# Altium schematic sheet 03_H3DRAM.SchDoc
size A2
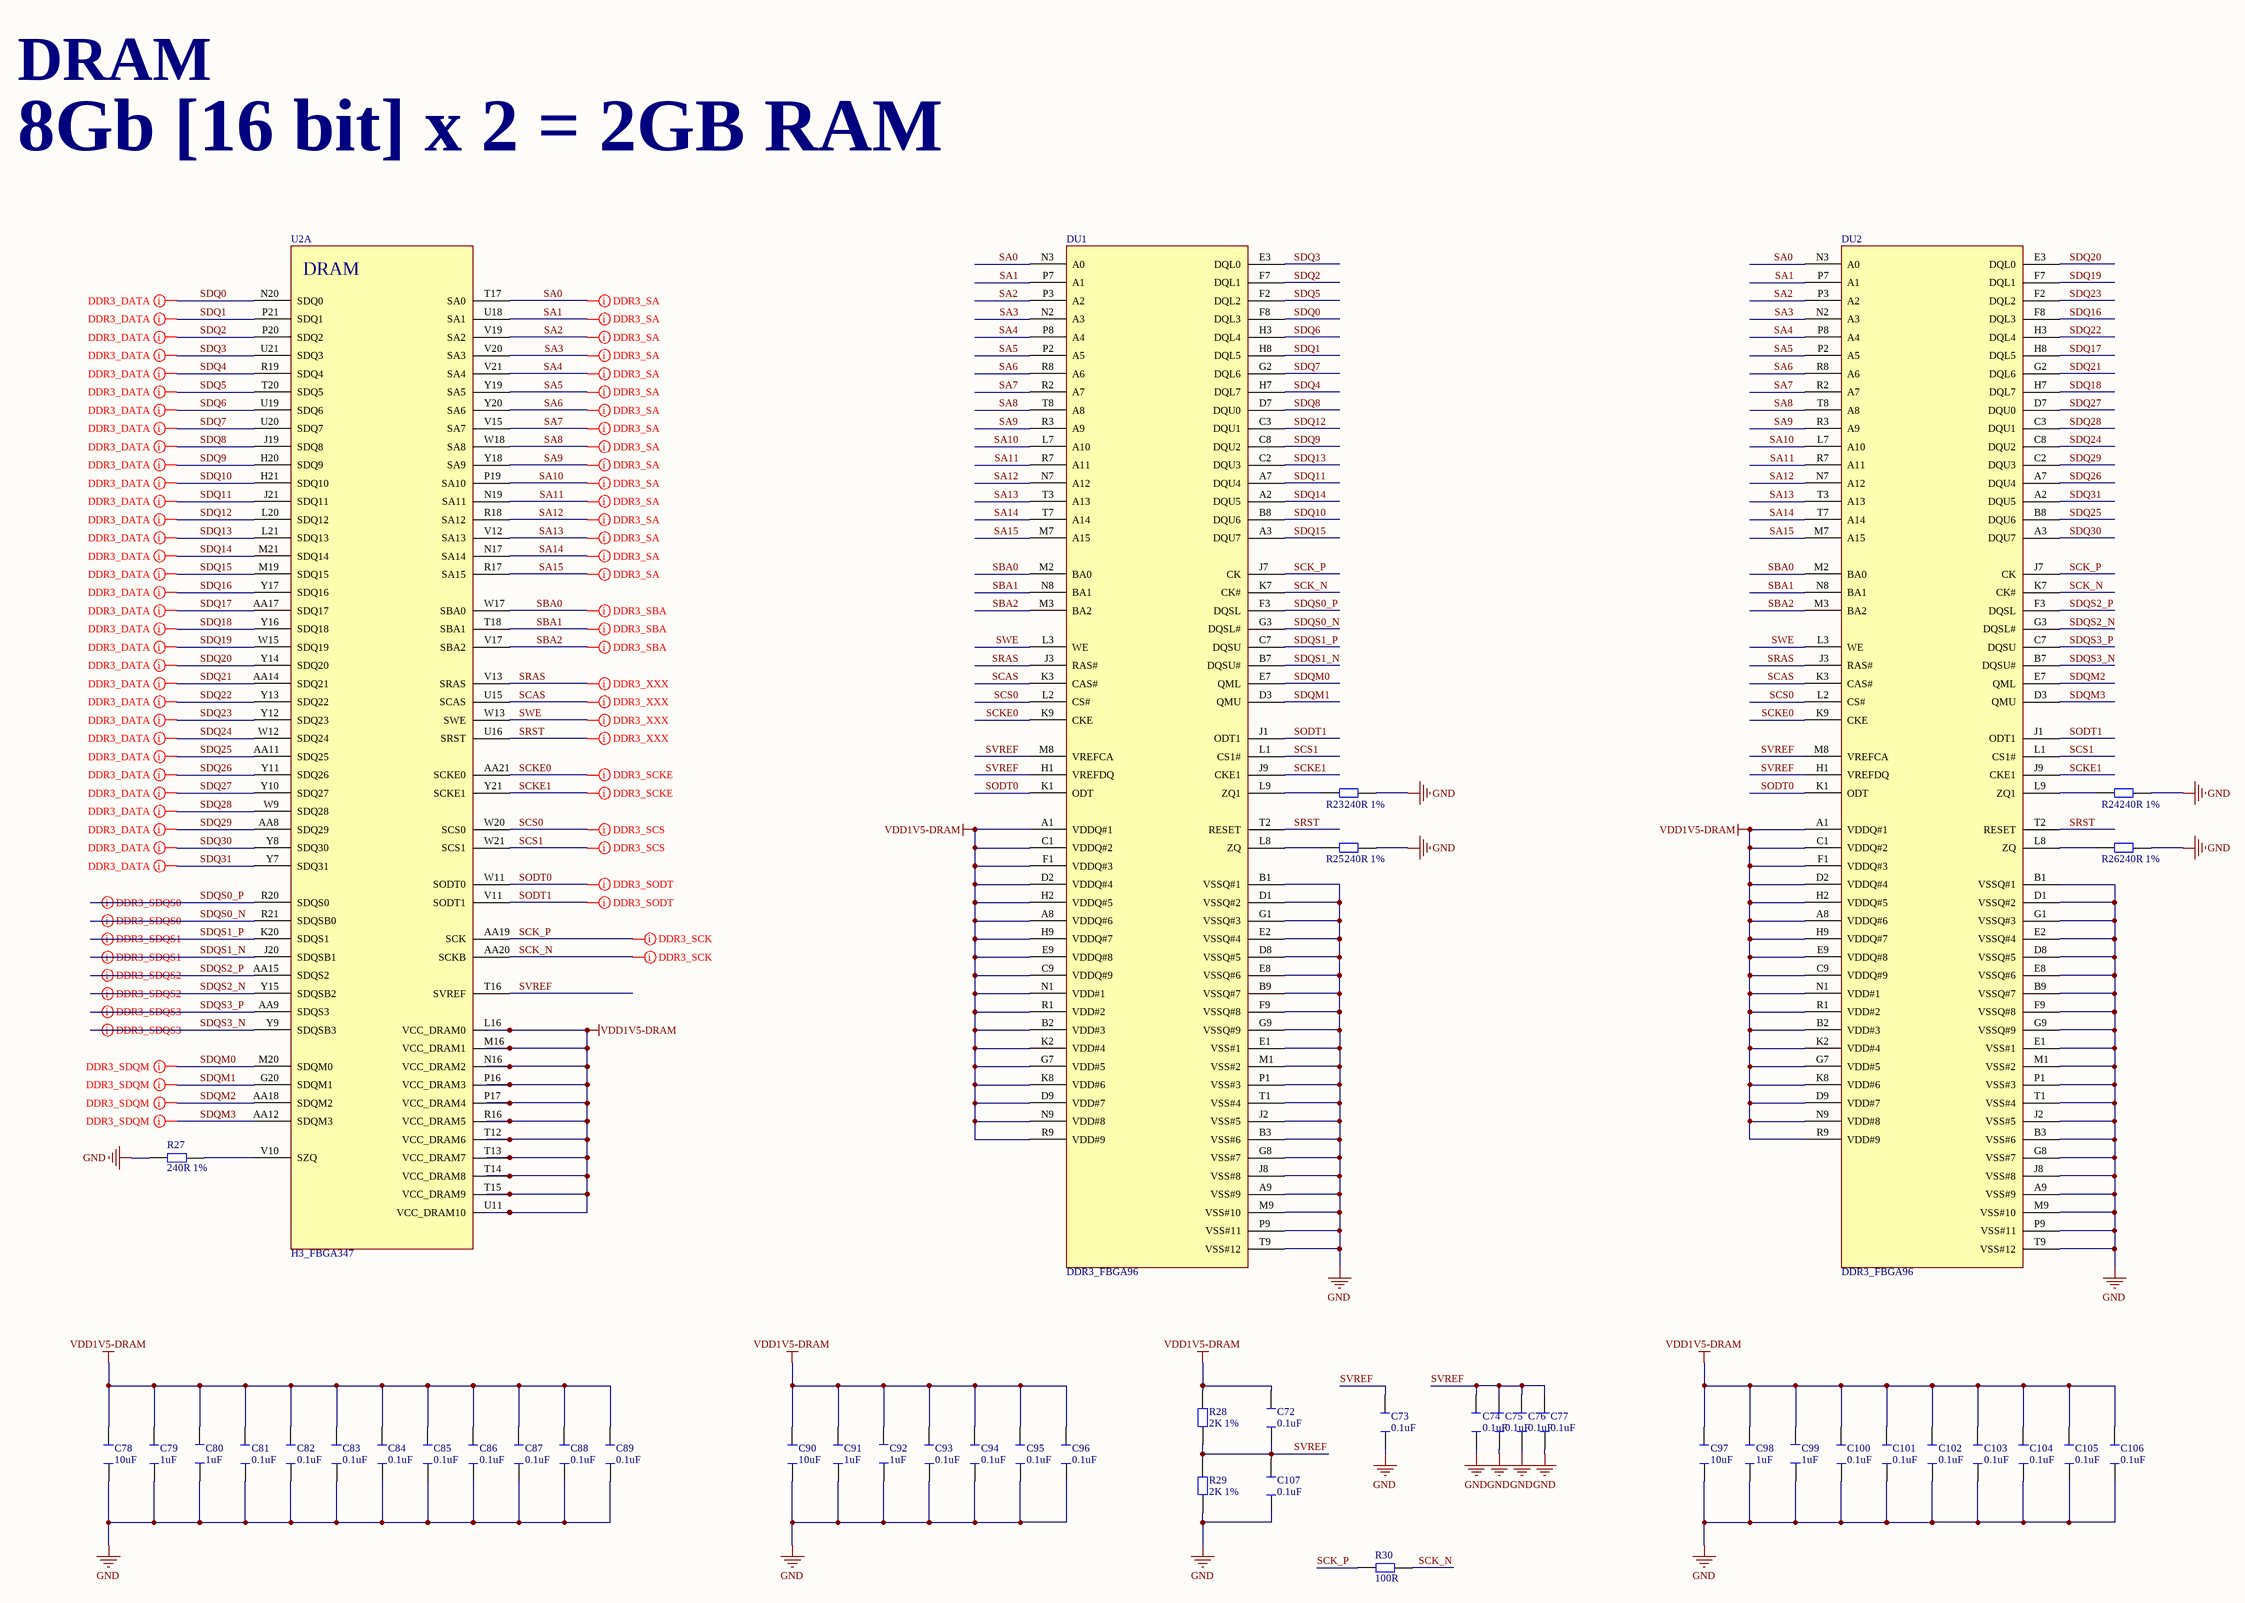
[diagram p0: 03_H3DRAM.SchDoc]

## Parts
C72  0.1uF  [C0402]
C73  0.1uF  [C0402]
C74  0.1uF  [C0402]
C75  0.1uF  [C0402]
C76  0.1uF  [C0402]
C77  0.1uF  [C0402]
C78  10uF  [C0402]
C79  1uF  [C0402]
C80  1uF  [C0402]
C81  0.1uF  [C0402]
C82  0.1uF  [C0402]
C83  0.1uF  [C0402]
C84  0.1uF  [C0402]
C85  0.1uF  [C0402]
C86  0.1uF  [C0402]
C87  0.1uF  [C0402]
C88  0.1uF  [C0402]
C89  0.1uF  [C0402]
C90  10uF  [C0402]
C91  1uF  [C0402]
C92  1uF  [C0402]
C93  0.1uF  [C0402]
C94  0.1uF  [C0402]
C95  0.1uF  [C0402]
C96  0.1uF  [C0402]
C97  10uF  [C0402]
C98  1uF  [C0402]
C99  1uF  [C0402]
C100  0.1uF  [C0402]
C101  0.1uF  [C0402]
C102  0.1uF  [C0402]
C103  0.1uF  [C0402]
C104  0.1uF  [C0402]
C105  0.1uF  [C0402]
C106  0.1uF  [C0402]
C107  0.1uF  [C0402]
DU1  DDR3_FBGA96  [DDR3_FBGA96]
DU2  DDR3_FBGA96  [DDR3_FBGA96]
R23  240R 1%  [R0402]
R24  240R 1%  [R0402]
R25  240R 1%  [R0402]
R26  240R 1%  [R0402]
R27  240R 1%  [R0402]
R28  2K 1%  [R0402]
R29  2K 1%  [R0402]
R30  100R  [R0402]
U2  H3_FBGA347  [H3_FBGA327]  (part A of 16)

## Nets
GND: C73.1 C74.1 C75.1 C76.1 C77.1 C78.1 C79.1 C80.2 C81.1 C82.1 C83.1 C84.1 C85.1 C86.1 C87.1 C88.1 C89.1 C90.1 C91.1 C92.2 C93.1 C94.1 C95.1 C96.1 C97.1 C98.1 C99.2 C100.1 C101.1 C102.1 C103.1 C104.1 C105.1 C106.1 C107.1 DU1.A9(VSS#9) DU1.B1(VSSQ#1) DU1.B3(VSS#6) DU1.B9(VSSQ#7) DU1.D1(VSSQ#2) DU1.D8(VSSQ#5) DU1.E1(VSS#1) DU1.E2(VSSQ#4) DU1.E8(VSSQ#6) DU1.F9(VSSQ#8) DU1.G1(VSSQ#3) DU1.G8(VSS#7) DU1.G9(VSSQ#9) DU1.J2(VSS#5) DU1.J8(VSS#8) DU1.M1(VSS#2) DU1.M9(VSS#10) DU1.P1(VSS#3) DU1.P9(VSS#11) DU1.T1(VSS#4) DU1.T9(VSS#12) DU2.A9(VSS#9) DU2.B1(VSSQ#1) DU2.B3(VSS#6) DU2.B9(VSSQ#7) DU2.D1(VSSQ#2) DU2.D8(VSSQ#5) DU2.E1(VSS#1) DU2.E2(VSSQ#4) DU2.E8(VSSQ#6) DU2.F9(VSSQ#8) DU2.G1(VSSQ#3) DU2.G8(VSS#7) DU2.G9(VSSQ#9) DU2.J2(VSS#5) DU2.J8(VSS#8) DU2.M1(VSS#2) DU2.M9(VSS#10) DU2.P1(VSS#3) DU2.P9(VSS#11) DU2.T1(VSS#4) DU2.T9(VSS#12) R23.1 R24.1 R25.1 R26.1 R27.1 R29.1
VDD1V5-DRAM: C72.2 C78.2 C79.2 C80.1 C81.2 C82.2 C83.2 C84.2 C85.2 C86.2 C87.2 C88.2 C89.2 C90.2 C91.2 C92.1 C93.2 C94.2 C95.2 C96.2 C97.2 C98.2 C99.1 C100.2 C101.2 C102.2 C103.2 C104.2 C105.2 C106.2 DU1.A1(VDDQ#1) DU1.A8(VDDQ#6) DU1.B2(VDD#3) DU1.C1(VDDQ#2) DU1.C9(VDDQ#9) DU1.D2(VDDQ#4) DU1.D9(VDD#7) DU1.E9(VDDQ#8) DU1.F1(VDDQ#3) DU1.G7(VDD#5) DU1.H2(VDDQ#5) DU1.H9(VDDQ#7) DU1.K2(VDD#4) DU1.K8(VDD#6) DU1.N1(VDD#1) DU1.N9(VDD#8) DU1.R1(VDD#2) DU1.R9(VDD#9) DU2.A1(VDDQ#1) DU2.A8(VDDQ#6) DU2.B2(VDD#3) DU2.C1(VDDQ#2) DU2.C9(VDDQ#9) DU2.D2(VDDQ#4) DU2.D9(VDD#7) DU2.E9(VDDQ#8) DU2.F1(VDDQ#3) DU2.G7(VDD#5) DU2.H2(VDDQ#5) DU2.H9(VDDQ#7) DU2.K2(VDD#4) DU2.K8(VDD#6) DU2.N1(VDD#1) DU2.N9(VDD#8) DU2.R1(VDD#2) DU2.R9(VDD#9) R28.2 U2.L16(VCC_DRAM0) U2.M16(VCC_DRAM1) U2.N16(VCC_DRAM2) U2.P16(VCC_DRAM3) U2.P17(VCC_DRAM4) U2.R16(VCC_DRAM5) U2.T12(VCC_DRAM6) U2.T13(VCC_DRAM7) U2.T14(VCC_DRAM8) U2.T15(VCC_DRAM9) U2.U11(VCC_DRAM10)
SA0: DU1.N3(A0) DU2.N3(A0) U2.T17(SA0)
SA1: DU1.P7(A1) DU2.P7(A1) U2.U18(SA1)
SA2: DU1.P3(A2) DU2.P3(A2) U2.V19(SA2)
SA3: DU1.N2(A3) DU2.N2(A3) U2.V20(SA3)
SA4: DU1.P8(A4) DU2.P8(A4) U2.V21(SA4)
SA5: DU1.P2(A5) DU2.P2(A5) U2.Y19(SA5)
SA6: DU1.R8(A6) DU2.R8(A6) U2.Y20(SA6)
SA7: DU1.R2(A7) DU2.R2(A7) U2.V15(SA7)
SA8: DU1.T8(A8) DU2.T8(A8) U2.W18(SA8)
SA9: DU1.R3(A9) DU2.R3(A9) U2.Y18(SA9)
SA10: DU1.L7(A10) DU2.L7(A10) U2.P19(SA10)
SA11: DU1.R7(A11) DU2.R7(A11) U2.N19(SA11)
SA12: DU1.N7(A12) DU2.N7(A12) U2.R18(SA12)
SA13: DU1.T3(A13) DU2.T3(A13) U2.V12(SA13)
SA14: DU1.T7(A14) DU2.T7(A14) U2.N17(SA14)
SA15: DU1.M7(A15) DU2.M7(A15) U2.R17(SA15)
SBA0: DU1.M2(BA0) DU2.M2(BA0) U2.W17(SBA0)
SBA1: DU1.N8(BA1) DU2.N8(BA1) U2.T18(SBA1)
SBA2: DU1.M3(BA2) DU2.M3(BA2) U2.V17(SBA2)
SCAS: DU1.K3(CAS#) DU2.K3(CAS#) U2.U15(SCAS)
SCK_N: DU1.K7(CK#) DU2.K7(CK#) R30.2 U2.AA20(SCKB)
SCK_P: DU1.J7(CK) DU2.J7(CK) R30.1 U2.AA19(SCK)
SCKE0: DU1.K9(CKE) DU2.K9(CKE) U2.AA21(SCKE0)
SCKE1: DU1.J9(CKE1) DU2.J9(CKE1) U2.Y21(SCKE1)
SCS0: DU1.L2(CS#) DU2.L2(CS#) U2.W20(SCS0)
SCS1: DU1.L1(CS1#) DU2.L1(CS1#) U2.W21(SCS1)
SDQ0: DU1.F8(DQL3) U2.N20(SDQ0)
SDQ1: DU1.H8(DQL5) U2.P21(SDQ1)
SDQ2: DU1.F7(DQL1) U2.P20(SDQ2)
SDQ3: DU1.E3(DQL0) U2.U21(SDQ3)
SDQ4: DU1.H7(DQL7) U2.R19(SDQ4)
SDQ5: DU1.F2(DQL2) U2.T20(SDQ5)
SDQ6: DU1.H3(DQL4) U2.U19(SDQ6)
SDQ7: DU1.G2(DQL6) U2.U20(SDQ7)
SDQ8: DU1.D7(DQU0) U2.J19(SDQ8)
SDQ9: DU1.C8(DQU2) U2.H20(SDQ9)
SDQ10: DU1.B8(DQU6) U2.H21(SDQ10)
SDQ11: DU1.A7(DQU4) U2.J21(SDQ11)
SDQ12: DU1.C3(DQU1) U2.L20(SDQ12)
SDQ13: DU1.C2(DQU3) U2.L21(SDQ13)
SDQ14: DU1.A2(DQU5) U2.M21(SDQ14)
SDQ15: DU1.A3(DQU7) U2.M19(SDQ15)
SDQ16: DU2.F8(DQL3) U2.Y17(SDQ16)
SDQ17: DU2.H8(DQL5) U2.AA17(SDQ17)
SDQ18: DU2.H7(DQL7) U2.Y16(SDQ18)
SDQ19: DU2.F7(DQL1) U2.W15(SDQ19)
SDQ20: DU2.E3(DQL0) U2.Y14(SDQ20)
SDQ21: DU2.G2(DQL6) U2.AA14(SDQ21)
SDQ22: DU2.H3(DQL4) U2.Y13(SDQ22)
SDQ23: DU2.F2(DQL2) U2.Y12(SDQ23)
SDQ24: DU2.C8(DQU2) U2.W12(SDQ24)
SDQ25: DU2.B8(DQU6) U2.AA11(SDQ25)
SDQ26: DU2.A7(DQU4) U2.Y11(SDQ26)
SDQ27: DU2.D7(DQU0) U2.Y10(SDQ27)
SDQ28: DU2.C3(DQU1) U2.W9(SDQ28)
SDQ29: DU2.C2(DQU3) U2.AA8(SDQ29)
SDQ30: DU2.A3(DQU7) U2.Y8(SDQ30)
SDQ31: DU2.A2(DQU5) U2.Y7(SDQ31)
SDQM0: DU1.E7(QML) U2.M20(SDQM0)
SDQM1: DU1.D3(QMU) U2.G20(SDQM1)
SDQM2: DU2.E7(QML) U2.AA18(SDQM2)
SDQM3: DU2.D3(QMU) U2.AA12(SDQM3)
SDQS0_N: DU1.G3(DQSL#) U2.R21(SDQSB0)
SDQS0_P: DU1.F3(DQSL) U2.R20(SDQS0)
SDQS1_N: DU1.B7(DQSU#) U2.J20(SDQSB1)
SDQS1_P: DU1.C7(DQSU) U2.K20(SDQS1)
SDQS2_N: DU2.G3(DQSL#) U2.Y15(SDQSB2)
SDQS2_P: DU2.F3(DQSL) U2.AA15(SDQS2)
SDQS3_N: DU2.B7(DQSU#) U2.Y9(SDQSB3)
SDQS3_P: DU2.C7(DQSU) U2.AA9(SDQS3)
SODT0: DU1.K1(ODT) DU2.K1(ODT) U2.W11(SODT0)
SODT1: DU1.J1(ODT1) DU2.J1(ODT1) U2.V11(SODT1)
SRAS: DU1.J3(RAS#) DU2.J3(RAS#) U2.V13(SRAS)
SRST: DU1.T2(RESET) DU2.T2(RESET) U2.U16(SRST)
SVREF: C72.1 C73.2 C74.2 C75.2 C76.2 C77.2 C107.2 DU1.H1(VREFDQ) DU1.M8(VREFCA) DU2.H1(VREFDQ) DU2.M8(VREFCA) R28.1 R29.2 U2.T16(SVREF)
SWE: DU1.L3(WE) DU2.L3(WE) U2.W13(SWE)
NetDU1_L8: DU1.L8(ZQ) R25.2
NetDU1_L9: DU1.L9(ZQ1) R23.2
NetDU2_L8: DU2.L8(ZQ) R26.2
NetDU2_L9: DU2.L9(ZQ1) R24.2
NetR27_2: R27.2 U2.V10(SZQ)

## Layout directives
net class DDR3_ADDR; rule Width Constraint [Pref Width = 5mil    Min Width = 4mil    Max Width = 5mil]; net class DDR3: SA0, SA1, SA2, SA3, SA4, SA5, SA6, SA7, SA8, SA9, SA10, SA11, SA12, SA13, SA14, SA15
net class DDR3_DATA; rule Width Constraint [Pref Width = 5mil    Min Width = 4mil    Max Width = 5mil]; net class DDR3_DQS1; net class DDR3: SDQ8, SDQ9, SDQ10, SDQ11, SDQ12, SDQ13, SDQ14, SDQ15
net class DDR3_DATA; rule Width Constraint [Pref Width = 5mil    Min Width = 4mil    Max Width = 5mil]; net class DDR3_DQS0; net class DDR3: SDQ0, SDQ1, SDQ2, SDQ3, SDQ4, SDQ5, SDQ6, SDQ7
net class DDR3_DATA; rule Width Constraint [Pref Width = 5mil    Min Width = 4mil    Max Width = 5mil]; net class DDR3_DQS3; net class DDR3: SDQ24, SDQ25, SDQ26, SDQ27, SDQ28, SDQ29, SDQ30, SDQ31
net class DDR3_DATA; rule Width Constraint [Pref Width = 5mil    Min Width = 4mil    Max Width = 5mil]; net class DDR3_DQS2; net class DDR3: SDQ16, SDQ17, SDQ18, SDQ19, SDQ20, SDQ21, SDQ22, SDQ23
differential pair; differential pair class DDR3_DIFF_DQS0; rule Differential Pairs Routing [Pref Gap = 6mil    Min Gap  = 6mil    Max Gap  = 6milPref Width = 4.29mil    Min Width  = 4.29mil    Max Width  = 4.29mil]; net class DDR3_DIFF_DQS0; net class DDR3_DQS0; net class DDR3: SDQS0_N, SDQS0_P
differential pair; differential pair class DDR3_DIFF_DQS1; rule Differential Pairs Routing [Pref Gap = 6mil    Min Gap  = 6mil    Max Gap  = 6milPref Width = 4.29mil    Min Width  = 4.29mil    Max Width  = 4.29mil]; net class DDR3_DIFF_DQS1; net class DDR3_DQS1; net class DDR3: SDQS1_N, SDQS1_P
differential pair; differential pair class DDR3_DIFF_DQS2; rule Differential Pairs Routing [Pref Gap = 6mil    Min Gap  = 6mil    Max Gap  = 6milPref Width = 4.29mil    Min Width  = 4.29mil    Max Width  = 4.29mil]; net class DDR3_DIFF_DQS2; net class DDR3_DQS2; net class DDR3: SDQS2_N, SDQS2_P
differential pair; differential pair class DDR3_DIFF_DQS3; rule Differential Pairs Routing [Pref Gap = 6mil    Min Gap  = 6mil    Max Gap  = 6milPref Width = 4.29mil    Min Width  = 4.29mil    Max Width  = 4.29mil]; net class DDR3_DIFF_DQS3; net class DDR3_DQS3; net class DDR3: SDQS3_N, SDQS3_P
net class DDR3_DQM; rule Width Constraint [Pref Width = 5mil    Min Width = 4mil    Max Width = 5mil]; net class DDR3; net class DDR3_DQS3: SDQM3
net class DDR3_DQM; rule Width Constraint [Pref Width = 5mil    Min Width = 4mil    Max Width = 5mil]; net class DDR3; net class DDR3_DQS2: SDQM2
net class DDR3_DQM; rule Width Constraint [Pref Width = 5mil    Min Width = 4mil    Max Width = 5mil]; net class DDR3; net class DDR3_DQS1: SDQM1
net class DDR3_DQM; rule Width Constraint [Pref Width = 5mil    Min Width = 4mil    Max Width = 5mil]; net class DDR3; net class DDR3_DQS0: SDQM0
net class DDR3_BA; rule Width Constraint [Pref Width = 5mil    Min Width = 4mil    Max Width = 5mil]; net class DDR3: SBA0, SBA1, SBA2
net class DDR3_ODT; rule Width Constraint [Pref Width = 5mil    Min Width = 4mil    Max Width = 5mil]; net class DDR3: SODT0, SODT1
net class DDR3_CS; rule Width Constraint [Pref Width = 5mil    Min Width = 4mil    Max Width = 5mil]; net class DDR3: SCS0, SCS1
net class DDR3_CKE; rule Width Constraint [Pref Width = 0.127mm    Min Width = 0.127mm    Max Width = 0.127mm]; net class DDR3: SCKE0, SCKE1
net class DDR3_XXX; rule Width Constraint [Pref Width = 0.127mm    Min Width = 0.127mm    Max Width = 0.127mm]; net class DDR3: SCAS, SRAS, SRST, SWE
differential pair; differential pair class DDR3_CK; rule Differential Pairs Routing [Pref Gap = 6mil    Min Gap  = 6mil    Max Gap  = 6milPref Width = 4.29mil    Min Width  = 4.29mil    Max Width  = 4.29mil]; net class DDR3_DIFF_CK; net class DDR3: SCK_N, SCK_P

## Notes on the sheet
- DRAM
- 8Gb [16 bit] x 2 = 2GB RAM
- (in symbol H3_FBGA347, part A) DRAM

## Library data of the parts
C72-C77 C81-C89 C93-C96 C100-C107 = C_0.1UF
C78 C90 C97 = C_10UF
C79 C80 C91 C92 C98 C99 = C_1UF
R23-R27 = R_240R_P1
R28 R29 = R_2K_P1
R30 = R_100R